# EAGLE design ATtiny programmer (EAGLE 9.6.2)
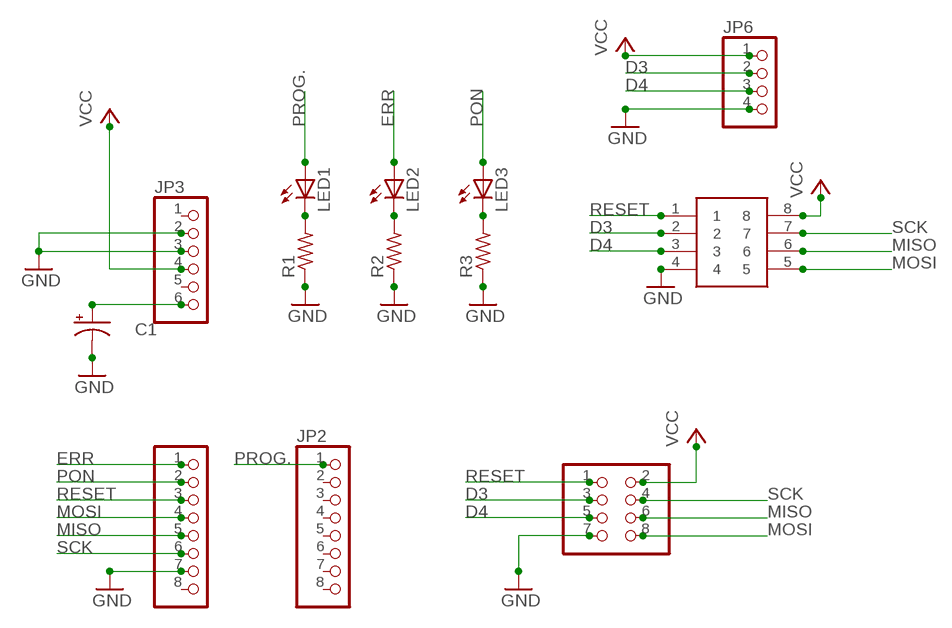
[diagram p0: schematic, sheet 1]

## Parts
C1  CPOL-USE5-6  [E5-6]
IC1  1-2199298-2  [DIPS762W70P254L1016H510Q8N]
JP1  PINHD-2X4  [2X04]
JP2  PINHD-1X8  [1X08]
JP3  PINHD-1X6  [1X06]
JP4  PINHD-1X8  [1X08]
JP6  PINHD-1X4  [1X04]
LED1  LED3MM  [LED3MM]
LED2  LED3MM  [LED3MM]
LED3  LED3MM  [LED3MM]
R1  R-US_0207/10  [0207/10]
R2  R-US_0207/10  [0207/10]
R3  R-US_0207/10  [0207/10]

## Nets
D3: IC1.2 JP1.3 JP6.2
D4: IC1.3 JP1.5 JP6.3
ERR: JP4.1 LED2.A
GND: C1.- IC1.4 JP1.7 JP3.2 JP3.3 JP4.7 JP6.4 R1.1 R2.1 R3.1
MISO: IC1.6 JP1.6 JP4.5
MOSI: IC1.5 JP1.8 JP4.4
N$1: C1.+ JP3.6
N$2: LED1.K(C) R1.2
N$3: LED2.K(C) R2.2
N$4: LED3.K(C) R3.2
PON: JP4.2 LED3.A
PROG.: JP2.1 LED1.A
RESET: IC1.1 JP1.1 JP4.3
SCK: IC1.7 JP1.4 JP4.6
VCC: IC1.8 JP1.2 JP3.4 JP6.1
Unconnected: JP2.2 JP2.3 JP2.4 JP2.5 JP2.6 JP2.7 JP2.8 JP3.1 JP3.5 JP4.8

## Library data of the parts
C1 = adafruit:CPOL-US: POLARIZED CAPACITOR, American symbol
IC1 = 1-2199298-2:1-2199298-2: TE CONNECTIVITY - 1-2199298-2 - IC SOCKET, DIP, 8POS, TH Source: Datasheet <https://componentsearchengine.com/Datasheets/2/1-2199298-2.pdf>; DESCRIPTION: TE CONNECTIVITY - 1-2199298-2 - IC SOCKET, DIP, 8POS, TH; HEIGHT: 5.1mm; MANUFACTURER_NAME: TE Connectivity; MANUFACTURER_PART_NUMBER: 1-2199298-2; MOUSER_PART_NUMBER: 571-1-2199298-2; MOUSER_PRICE-STOCK: https://www.mouser.co.uk/ProductDetail/TE-Connectivity/1-2199298-2?qs=fK8dlpkaUMtEKa4wabwOXQ%3D%3D
JP1 = pinhead:PINHD-2X4: PIN HEADER
JP2 JP4 = pinhead:PINHD-1X8: PIN HEADER
JP3 = pinhead:PINHD-1X6: PIN HEADER
JP6 = pinhead:PINHD-1X4: PIN HEADER
LED1-LED3 = adafruit:LED: LED OSRAM: - CHIPLED LG R971, LG N971, LY N971, LG Q971, LY Q971, LO R971, LY R971 LH N974, LH R974 LS Q976, LO Q976, LY Q976 LO Q996 - Hyper CHIPLED LW Q18S LB Q993, LB Q99A, LB R99A - SideLED LS A670, LO A670, LY A670, LG A670, LP A670 LB A673, LV A673, LT A673, LW A673 LH A674 LY A675 LS A676, LA A676, LO A676, LY A676, LW A676 LS A679, LY A679, LG A679 - Hyper Micro SIDELED® LS Y876, LA Y876, LO Y876, LY Y876 LT Y87S - SmartLED LW L88C, LW L88S LB L89C, LB L89S, LG L890 LS L89K, LO L89K, LY L89K LS L896, LA L896, LO L896, LY L896 - TOPLED LS T670, LO T670, LY T670, LG T670, LP T670 LSG T670, LSP T670, LSY T670, LOP T670, LYG T670 LG T671, LOG T671, LSG T671 LB T673, LV T673, LT T673, LW T673 LH T674 LS T676, LA T676, LO T676, LY T676, LB T676, LH T676, LSB T676, LW T676 LB T67C, LV T67C, LT T67C, LS T67K, LO T67K, LY T67K, LW E67C LS E67B, LA E67B, LO E67B, LY E67B, LB E67C, LV E67C, LT E67C LW T67C LS T679, LY T679, LG T679 LS T770, LO T770, LY T770, LG T770, LP T770 LB T773, LV T773, LT T773, LW T773 LH T774 LS E675, LA E675, LY E675, LS T675 LS T776, LA T776, LO T776, LY T776, LB T776 LHGB T686 LT T68C, LB T68C - Hyper Mini TOPLED® LB M676 - Mini TOPLED Santana® LG M470 LS M47K, LO M47K, LY M47K Source: http://www.osram.convergy.de/
R1-R3 = adafruit:R-US_: RESISTOR, American symbol

## Board
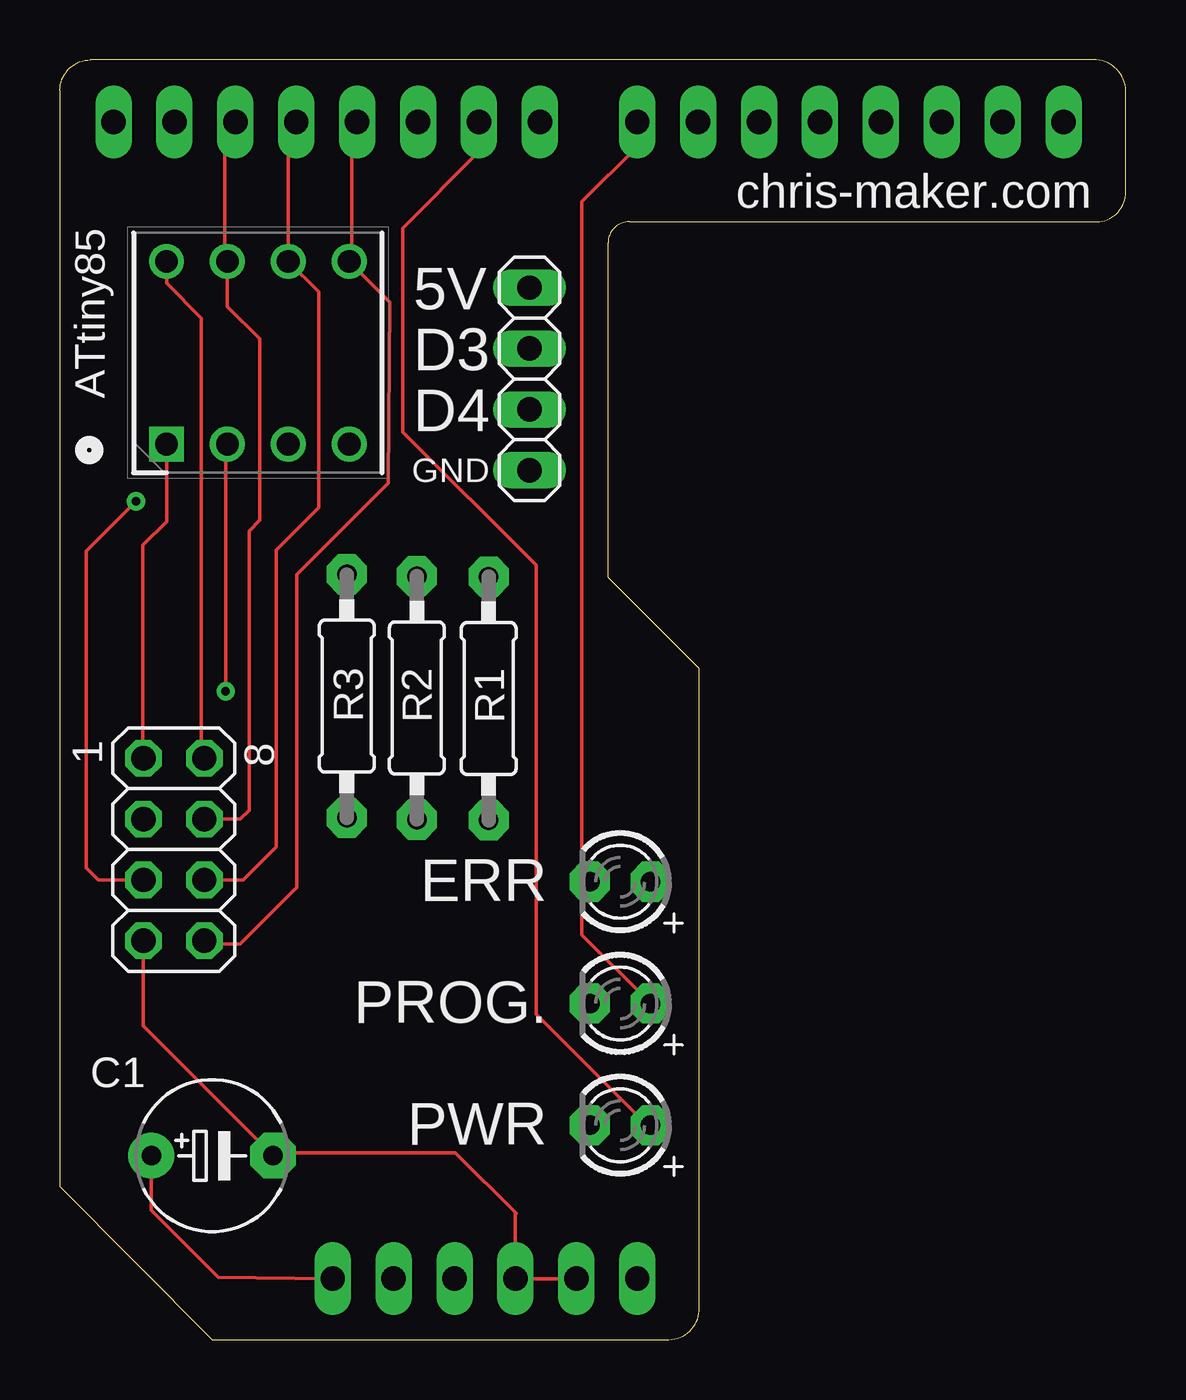
[diagram p1: board, top side]
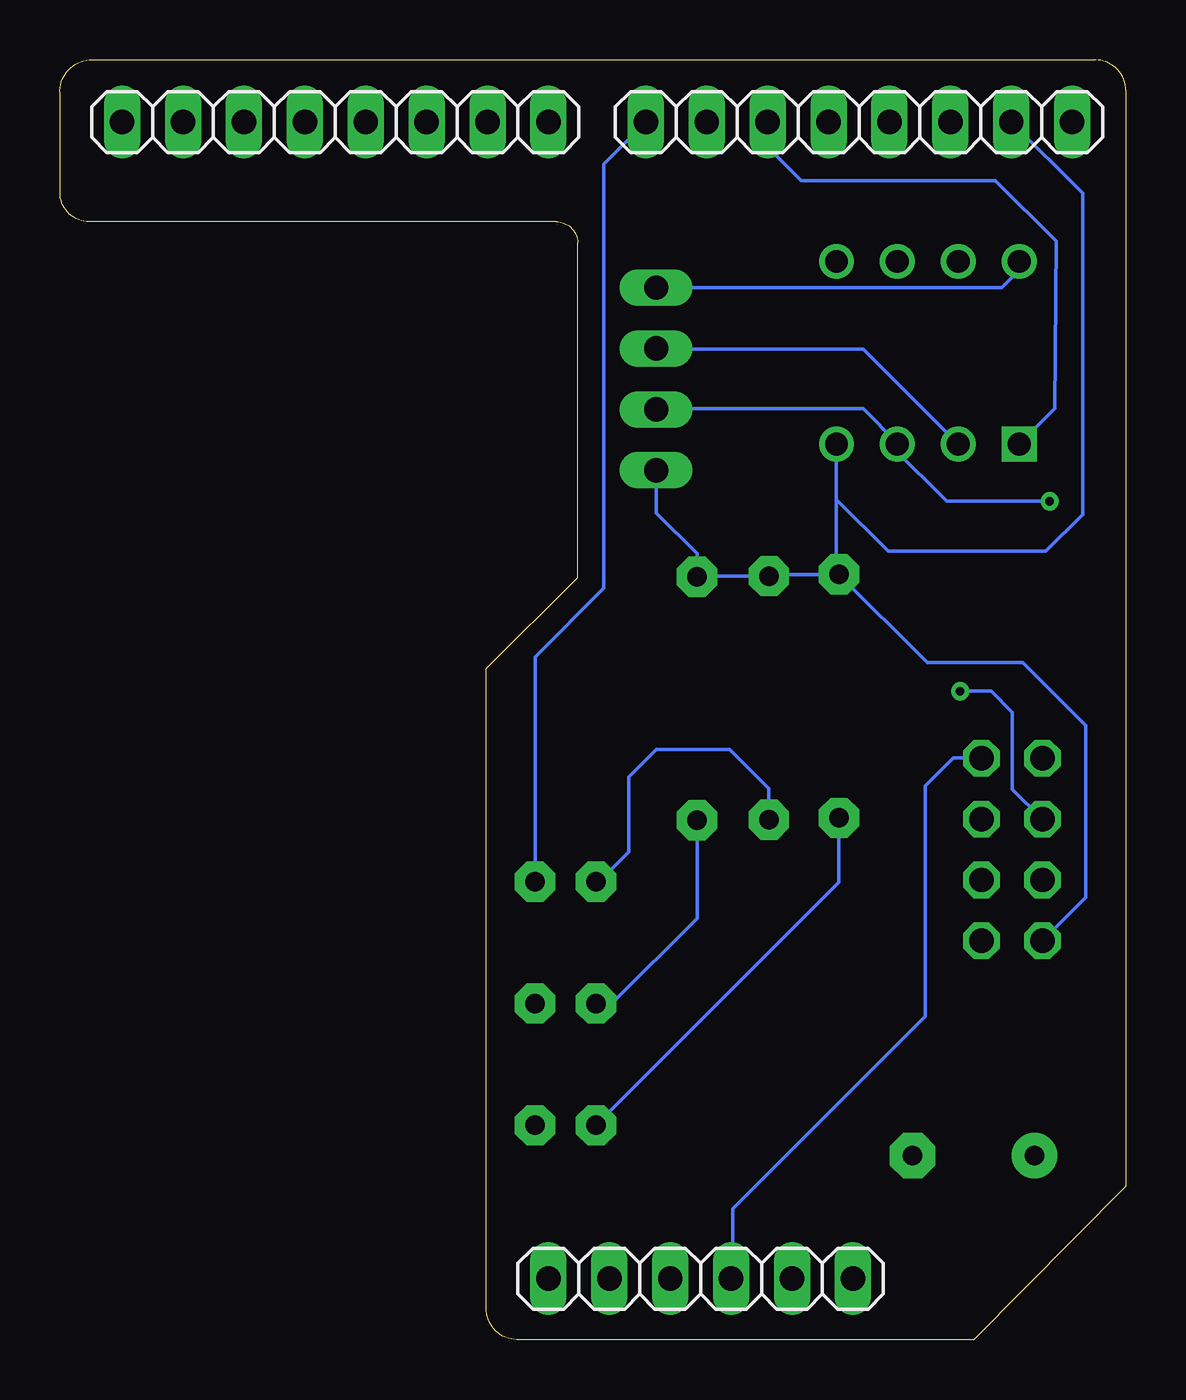
[diagram p2: board, bottom side, seen from below]

Size 44.45 x 53.39 mm. Coordinates in mm from the lower left corner, seen from the top.
Outline: 6.35,0 25.4,0 arc90 26.67,1.32 26.67,27.99 22.86,31.8 22.86,45.77 arc-90 23.75,46.63 43.23,46.63 arc90 44.45,47.88 44.45,51.99 arc90 43.23,53.39 1.27,53.39 arc90 0,52.12 0,6.4 6.35,0
Copper layers (1*16): Top 0.035mm / dielectric 1.5mm / Bottom 0.035mm
Design rules "default": minimum track width 6mil, minimum drill 0.35mm, track to track 6mil, track to pad 6mil, pad to pad 6mil, via to via 6mil, smd to smd 6mil, copper to edge 40mil, drill to drill 6mil, minimum pad ring 10mil, minimum via ring 8mil, stop-mask expansion 4mil, vias tented up to drill 0mil, thermal gap 10mil

### Footprints (pad centres in the part's own frame; a part is rotated, then mirrored left to right if it is on the bottom)
E5-6 = drill 0.813 pad 1.905: + -2.54,0 | drill 0.813 pad 1.905 octagon: - 2.54,0
DIPS762W70P254L1016H510Q8N = drill 0.95 pad 1.425 square: 1 0,0 | drill 0.95 pad 1.425: 2 0,-2.54; 3 0,-5.08; 4 0,-7.62; 5 7.62,-7.62; 6 7.62,-5.08; 7 7.62,-2.54; 8 7.62,0
2X04 = drill 1.016 octagon: 1 -3.81,-1.27; 2 -3.81,1.27; 3 -1.27,-1.27; 4 -1.27,1.27; 5 1.27,-1.27; 6 1.27,1.27; 7 3.81,-1.27; 8 3.81,1.27
1X08 = drill 1.016 long: 1 -8.89,0; 2 -6.35,0; 3 -3.81,0; 4 -1.27,0; 5 1.27,0; 6 3.81,0; 7 6.35,0; 8 8.89,0
1X06 = drill 1.016 long: 1 -6.35,0; 2 -3.81,0; 3 -1.27,0; 4 1.27,0; 5 3.81,0; 6 6.35,0
1X04 = drill 1.016 long: 1 -3.81,0; 2 -1.27,0; 3 1.27,0; 4 3.81,0
LED3MM = drill 0.813 pad 1.676 octagon: A -1.27,0; K 1.27,0
0207/10 = drill 0.813 pad 1.676 octagon: 1 -5.08,0; 2 5.08,0

### Placement (x,y rotation side)
C1  6.35,7.67 0 top
IC1  4.45,37.36 90 top
JP1  4.75,20.45 270 top
JP2  32.97,50.8 180 bottom
JP3  17.73,2.54 0 bottom
JP4  11.13,50.8 0 bottom
JP6  19.58,40.08 270 top
LED1  23.37,14.02 180 top
LED2  23.37,19.1 180 top
LED3  23.37,8.94 180 top
R1  17.88,26.75 270 top
R2  14.88,26.77 270 top
R3  11.96,26.85 270 top

### Tracks (layer width: path | path; a pad name or v marks a point on that pad's centre or on a via)
D3  (via drill 0.35)
  Top 0.152: v6.91,27.05 6.91,37.29 IC1.2
  Bottom 0.152: IC1.2 10.95,41.33 19.56,41.33 JP6.2 | JP1.3 4.72,22.96 4.72,26.16 5.61,27.05 v6.91,27.05
D4  (via drill 0.35)
  Top 0.152: JP1.5 1.6,19.18 1.09,19.68 1.09,32.89 v3.17,34.98
  Bottom 0.152: v3.17,34.98 7.47,34.98 9.69,37.2 IC1.3 9.52,37.41 10.95,38.84 19.56,38.84 JP6.3
ERR
  Bottom 0.152: JP4.1 21.77,49.05 21.77,31.35 24.64,28.48 LED2.A
GND
  Top 0.152: C1.- 8.76,7.8 | 8.76,7.8 3.48,13.08 JP1.7 | JP3.2 JP3.3 19,5.23 19.02,5.26 16.48,7.8 8.76,7.8
  Bottom 0.152: R2.1 14.96,31.85 | 14.96,31.85 17.86,31.85 R1.1 17.88,32.79 19.58,34.49 JP6.4 | 12.04,31.93 R3.1 8.28,28.24 4.29,28.24 1.68,25.63 1.68,18.44 JP1.7 | 12.04,31.93 14.88,31.93 14.96,31.85 | JP4.7 1.8,47.83 1.8,34.42 3.33,32.89 9.91,32.89 12.06,35.05 IC1.4 12.06,31.95 12.04,31.93
MISO
  Top 0.152: JP4.5 9.52,50.47 IC1.6 10.8,43.71 10.8,34.72 9.02,32.94 9.02,20.55 7.65,19.18 JP1.6
MOSI
  Top 0.152: JP4.4 12.17,50.57 12.17,45.08 IC1.5 13.76,43.29 13.69,35.74 9.88,31.93 9.88,18.87 7.52,16.51 6.15,16.51 JP1.8
N$1
  Top 0.152: C1.+ 3.81,5.38 6.6,2.59 JP3.6
N$2
  Bottom 0.152: R1.2 17.88,17.58 21.44,14.02 LED1.K
N$3
  Bottom 0.152: R2.2 14.88,22.99 16.51,24.61 19.58,24.61 20.73,23.47 20.73,20.35 21.97,19.1 LED2.K
N$4
  Bottom 0.152: R3.2 11.96,19.08 LED3.K
PON
  Top 0.152: JP4.2 17.48,49.56 14.3,46.38 14.3,37.87 19.86,32.31 19.86,13.56 24.49,8.94 LED3.A
PROG.
  Top 0.152: LED1.A 21.77,16.89 21.77,47.47 24.08,49.78 JP2.1
RESET
  Top 0.152: JP1.1 3.45,24.28 3.45,33.15 4.45,34.14 IC1.1
  Bottom 0.152: JP4.3 14.95,49.78 13.54,48.36 5.44,48.36 2.9,45.83 2.96,38.85 IC1.1
SCK
  Top 0.152: JP4.6 6.88,50.37 6.88,45.08 IC1.7 6.98,43.1 8.33,41.76 8.33,34.19 7.89,33.74 7.89,22.08 7.52,21.72 JP1.4
VCC
  Top 0.152: IC1.8 4.45,44.07 5.89,42.62 5.89,24.38 JP1.2
  Bottom 0.152: JP1.2 7.19,24.26 8.36,23.09 8.36,13.49 16.38,5.46 16.38,2.62 JP3.4 | IC1.8 4.45,44.63 5.18,43.89 JP6.1

### Text on the board
tPlace: chris-maker.com | 5V | D3 | ATtiny85 | GND | 1 | 8 | PROG. | PWR
tNames: D4 | ERR